# Altium schematic sheet PWR.SchDoc
size A3
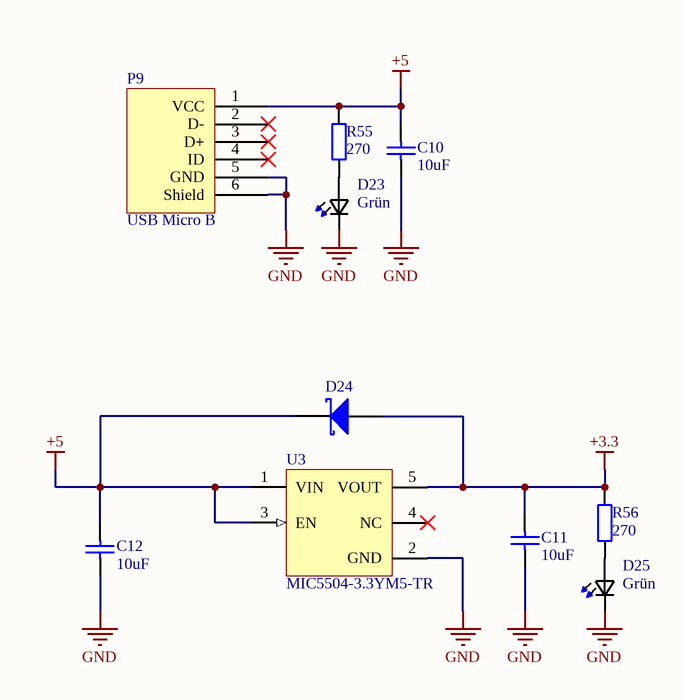
[diagram p0: PWR.SchDoc]

## Parts
C10  10uF  [CAP_0805i_2012m -N]
C11  10uF  [CAP_0805i_2012m -N]
C12  10uF  [CAP_0805i_2012m -N]
D23  Grün  [*0603]
D24  Diode  Schottky  [SOD123]  (value not drawn)
D25  Grün  [*0603]
P9  USB Micro B  [MCR-B-S-RA-SMT-EH4B-T/R]
R55  270  [RES_0603i_1608m -N]
R56  270  [RES_0603i_1608m -N]
U3  MIC5504-3.3YM5-TR  [MCHP-SOT-23-M5_V]

## Nets
+3.3: C11.2 D24.1(A) R56.2 U3.5(VOUT)
+5: C10.2 C12.2 D24.2(K) P9.1(VCC) R55.2 U3.1(VIN) U3.3(EN)
GND: C10.1 C11.1 C12.1 D23.1(K2) D25.1(K2) P9.5(GND) P9.6(Shield) U3.2(GND)
NetD23_2: D23.2(A2) R55.1
NetD25_2: D25.2(A2) R56.1

Not connected (* = marked no-connect by the designer): P9 2(D-)* 3(D+)* 4(ID)*; U3 4(NC)*

## Notes on the sheet
- 1
- 2
- 3
- 4
- 5
- 6
- 7
- 8
- A
- B
- C
- D
- Project:
- Date:
- Drawing number:
- Rev:
- Format:
- A3
- Drawn by:
- Laboratory:
- Page
- Sheet:
- of
- File:

## Library data of the parts
C10-C12 = Cap: capacitor
D23 D25 = LTST-C191KGKT: / LED; SMD; 0603; grün; 35mcd; 1.6x0.8x0.55mm; 130Â°; 2Ã·2.V; 20mA /; MF: Lite-On Inc.; Digi-Key_Purchase_URL: https://www.digikey.ch/product-detail/de/lite-on-inc/LTST-C191KGKT/160-1446-1-ND/386834; SnapEDA_Link: https://www.snapeda.com/parts/LTST-C191KFKT/Lite-On%20Inc./view-part/?ref=snap; MP: LTST-C191KGKT; Digi-Key_Part_Number: 160-1446-1-ND; Package: 0603 Lite-On; Value: *
D24 = Diode  Schottky: Schottky Diode
P9 = USB Mikro B
R55 R56 = Res: Resistor
U3 = CMP-2000-07604-1: Single LDO, 2.5 to 5.5 V, Fixed Out 3.3 V, 0.3 A, -40 to 125 degC, 5-Pin SOT-23 (M5), RoHS, Tape and Reel; Manufacturer: Microchip; Number of Regulators: 1; Dropout Voltage: 160mV; Output Current: 300mA; Min Input Voltage: 2.5V; Nominal Output Voltage: 3.3V; Max Input Voltage: 5.5V; Min Current Limit: 400mA; Number of Pins: 5; RoHSCompliant: True; Min Operating Temperature: -40degC; Case\/Package: SOT-23; Datasheet URL: http://ww1.microchip.com/downloads/en/DeviceDoc/MIC550X.pdf; Package Description: 5-Pin Small Outline Transistor, Body 1.6 x 2.9 mm, Pitch 0.95 mm; Max Operating Temperature: 125degC; Packaging: CutTape; Manufacturer URL: http://www.microchip.com/; Package Reference: SOT-23; Mount: SurfaceMount; Output Voltage: 3.3V; Mounting Technology: SurfaceMount; Lead Free: LeadFree; REACH SVHC: NoSVHC; Datasheet Version: Rev. 2.3, 04/2015